# EAGLE design BrainControlBoard (EAGLE 8.4.3)
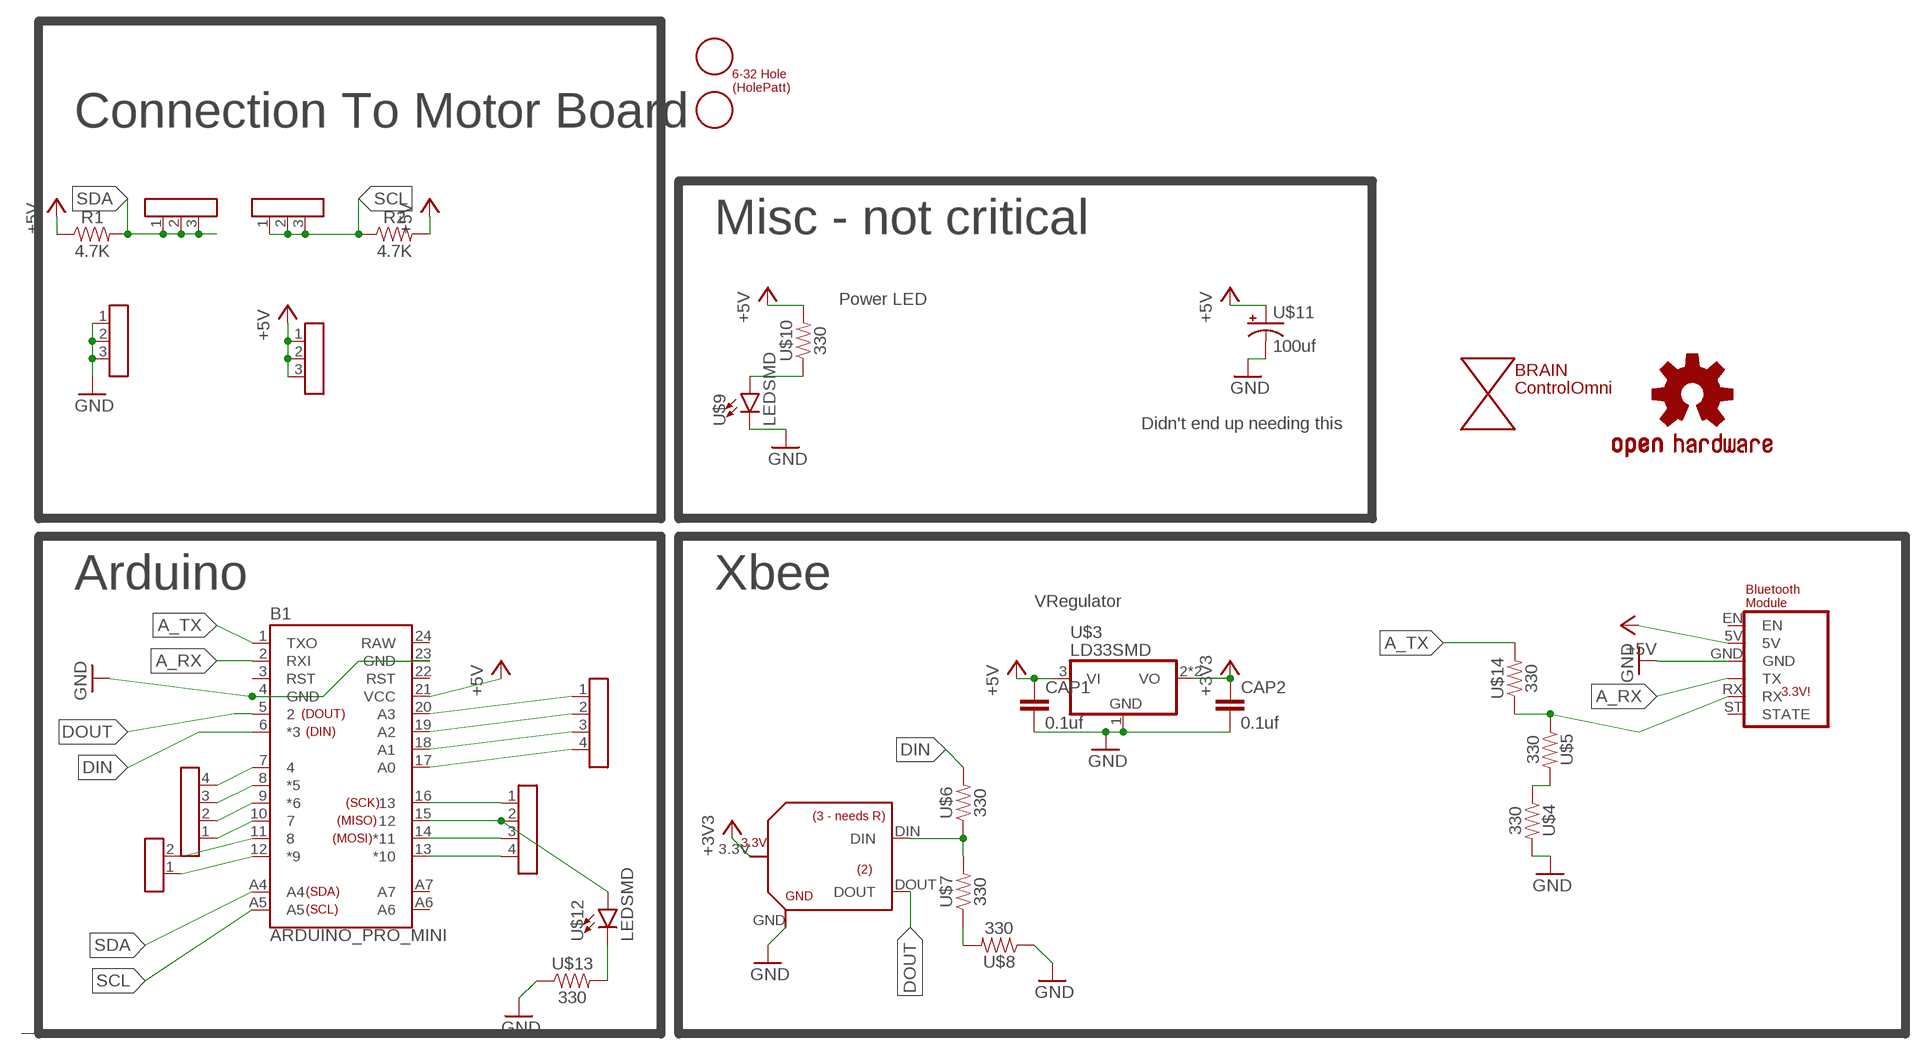
[diagram p0: schematic, sheet 1]

## Parts
B1  ARDUINO_PRO_MINI  [ARDUINO_PRO_MINI]
BRAIN  ControlOmni  ANNOTATION  [ANNOTATION]
CAP1  0.1uf  CAP_SMCAP  [C1206]
CAP2  0.1uf  CAP_SMCAP  [C1206]
LOGO1  OSHW-LOGOM  [OSHW-LOGO-M]
R1  4.7K  RESISTORSMD  [R1206]
R2  4.7K  RESISTORSMD  [R1206]
U$1  BLUETOOTH  [BLUETOOTH]
U$2  XBEE_BOUT  [XBEE_BOUT]
U$3  LD33SMD  [SOT223]
U$4  330  RESISTORSMD  [R1206]
U$5  330  RESISTORSMD  [R1206]
U$6  330  RESISTORSMD  [R1206]
U$7  330  RESISTORSMD  [R1206]
U$8  330  RESISTORSMD  [R1206]
U$9  LEDSMD  [LED_SMD]
U$10  330  RESISTORSMD  [R1206]
U$11  100uf  CAP_EMED  [CAP_E]
U$12  LEDSMD  [LED_SMD]
U$13  330  RESISTORSMD  [R1206]
U$14  330  RESISTORSMD  [R1206]
U$15  3XHEADER  [3XHEADER]
U$16  3XHEADER  [3XHEADER]
U$17  3XHEADER  [3XHEADER]
U$18  3XHEADER  [3XHEADER]
U$19  4XHEADER  [4XHEADER]
U$20  4XHEADER  [4XHEADER]
U$21  2XHEADER  [2XHEADER]
U$22  4XHEADER  [4XHEADER]
U$23  632X2  [632X2]

## Nets
+3V3 [pow]: CAP2.1 U$2.3.3V U$3.2(VO) U$3.4(VO)
+5V [pow]: B1.21(VCC) CAP1.1 R1.1 R2.2 U$1.5V U$3.3(VI) U$10.2 U$11.+ U$16.1 U$16.2 U$16.3
A0: B1.17(A0) U$19.4
A1: B1.18(A1) U$19.3
A2: B1.19(A2) U$19.2
A3: B1.20(A3) U$19.1
A_RX: B1.2(RXI) U$1.TX
A_TX: B1.1(TXO) U$14.2
DIN: B1.6(*3) U$6.2
DOUT: B1.5 U$2.DOUT
GND [pow]: B1.4(GND) B1.23(GND) CAP1.2 CAP2.2 U$1.GND U$2.GND U$3.1(GND) U$4.2 U$8.1 U$9.C U$11.- U$13.1 U$15.1 U$15.2 U$15.3
N$1: U$9.A U$10.1
N$3: U$7.1 U$8.2
N$4: U$2.DIN U$6.1 U$7.2
N$5: U$12.C U$13.2
N$6: U$4.1 U$5.2
N$7: U$1.RX U$5.1 U$14.1
P4: B1.7 U$20.4
P5: B1.8(*5) U$20.3
P6: B1.9(*6) U$20.2
P7: B1.10 U$20.1
P8: B1.11 U$21.2
P9: B1.12(*9) U$21.1
P10: B1.13(*10) U$22.4
P11: B1.14(*11) U$22.3
P12: B1.15 U$12.A U$22.2
P13: B1.16 U$22.1
SCL: B1.A5 R2.1 U$18.1 U$18.2 U$18.3
SDA: B1.A4 R1.2 U$17.1 U$17.2 U$17.3
Unconnected: B1.3(RST) B1.22(RST) B1.A6 B1.A7 U$1.EN U$1.ST(STATE)

## Notes on the sheet
- Connection To Motor Board
- Misc - not critical
- Power LED
- Didn't end up needing this
- Arduino | Xbee
- VRegulator

## Power pins joined to a net without a drawn wire
RAW: B1.24(RAW)

## Library data of the parts
B1 = Richard_Micros:ARDUINO_PRO_MINI: SparkFun Pro Mini Pro Mini compatible footprint. Dimensions: 0.7 x 1.3" PCB Thickness: 0.8mm SparkFun Products: 3.3V/8MHz <https://www.sparkfun.com/products/11114> 5V/16MHz <https://www.sparkfun.com/products/11113>
BRAIN = Richard_Symbols:ANNOTATION
CAP1 CAP2 = Richard_Components:CAP_SM
LOGO1 = Richard_Symbols:OSHW-LOGO: Open-Source Hardware (OSHW) Logo This logo indicates the piece of hardware it is found on incorporates a OSHW license and/or adheres to the definition of open source hardware found here: http://freedomdefined.org/OSHW
R1 R2 U$4-U$8 U$10 U$13 U$14 = Richard_Components:RESISTOR
U$1 = Richard_Boards:BLUETOOTH
U$2 = Richard_Boards:XBEE_BOUT
U$3 = Richard_Components:LD33
U$9 U$12 = Richard_Components:LED
U$11 = Richard_Components:CAP_E
U$15-U$18 = Richard_Headers:3XHEADER
U$19 U$20 U$22 = Richard_Headers:4XHEADER
U$21 = Richard_Headers:2XHEADER
U$23 = Richard_Holes:632X2

## Net classes
0 default: width 0.254 mm
1 pow: width 0.508 mm

## Board
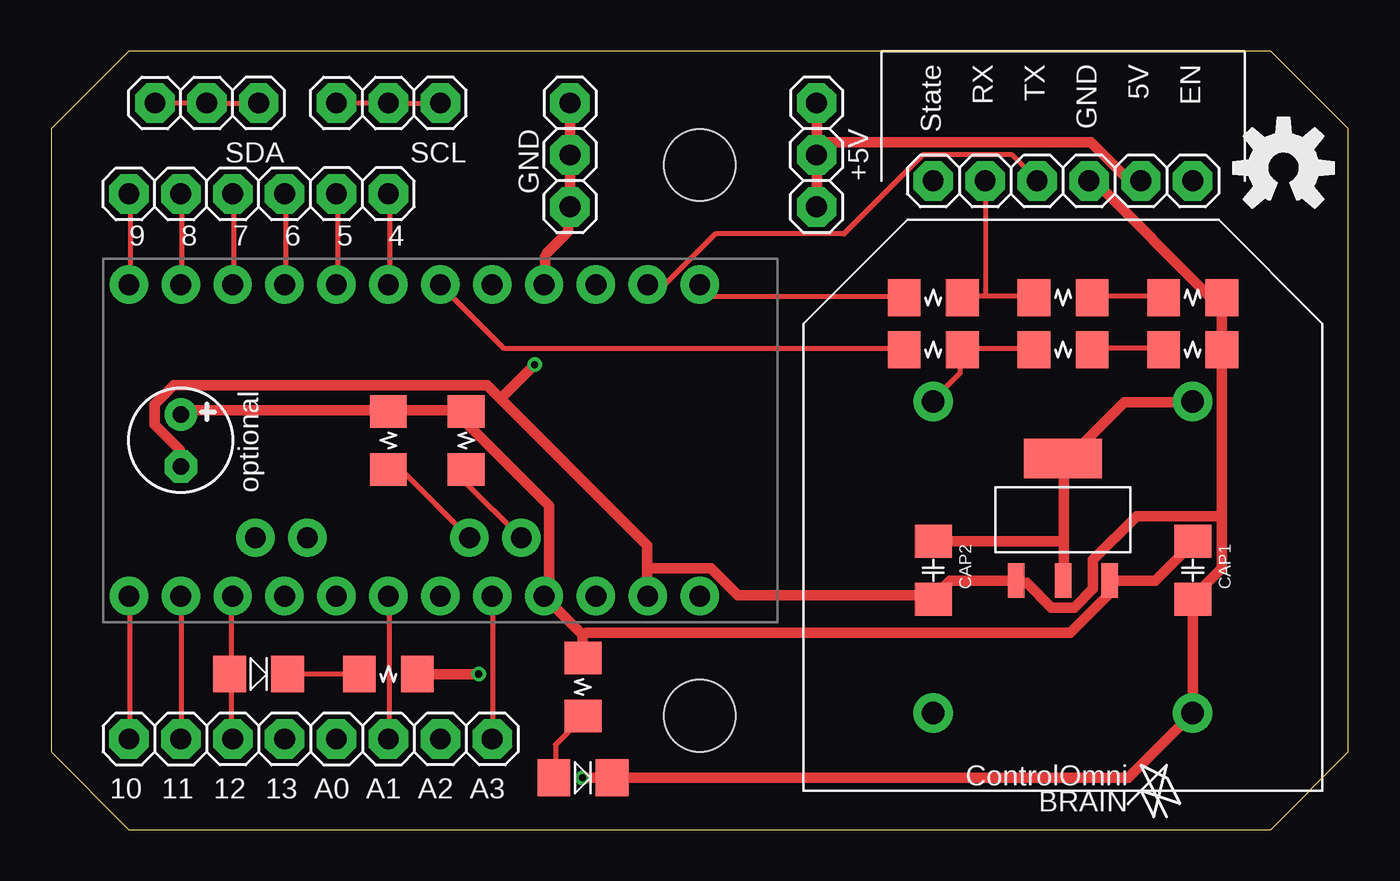
[diagram p1: board, top side]
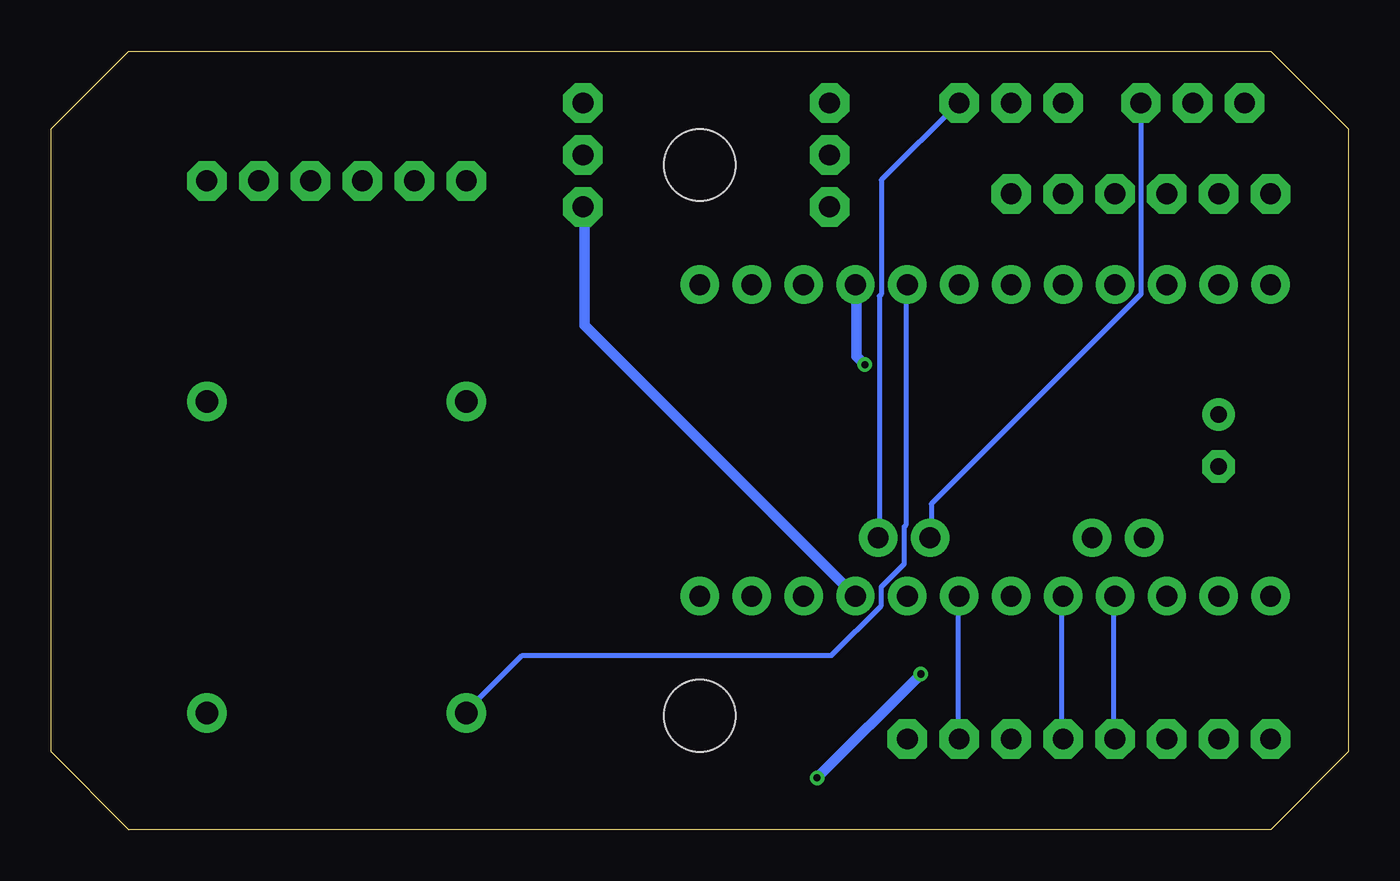
[diagram p2: board, bottom side, seen from below]

Size 63.5 x 38.1 mm. Coordinates in mm from the lower left corner, seen from the top.
Outline: 3.81,0 59.69,0 63.5,3.81 63.5,34.29 59.69,38.1 3.81,38.1 0,34.29 0,3.81 3.81,0
Copper layers (1*16): Top 0.0356mm / dielectric 1.5011mm / Bottom 0.0356mm
Design rules "LaenPCBOrder": minimum track width 6mil, minimum drill 13mil, track to track 6mil, track to pad 6mil, pad to pad 6mil, via to via 6mil, smd to smd 6mil, copper to edge 15mil, drill to drill 6mil, minimum pad ring 7mil, minimum via ring 7mil, stop-mask expansion 3mil, vias tented up to drill 0mil, thermal gap 10mil

### Footprints (pad centres in the part's own frame; a part is rotated, then mirrored left to right if it is on the bottom)
ARDUINO_PRO_MINI = drill 1.016 pad 1.88: 1 -7.62,12.7; 2 -7.62,10.16; 3 -7.62,7.62; 4 -7.62,5.08; 5 -7.62,2.54; 6 -7.62,0; 7 -7.62,-2.54; 8 -7.62,-5.08; 9 -7.62,-7.62; 10 -7.62,-10.16; 11 -7.62,-12.7; 12 -7.62,-15.24; 13 7.62,-15.24; 14 7.62,-12.7; 15 7.62,-10.16; 16 7.62,-7.62; 17 7.62,-5.08; 18 7.62,-2.54; 19 7.62,0; 20 7.62,2.54; 21 7.62,5.08; 22 7.62,7.62; 23 7.62,10.16; 24 7.62,12.7; A4 4.763,1.429; A5 4.763,3.969; A6 4.763,-9.049; A7 4.763,-6.509
C1206 = smd 1.6 x 1.803: 1 -1.422,0; 2 1.422,0
R1206 = smd 1.6 x 1.803: 1 -1.422,0; 2 1.422,0
BLUETOOTH = drill 1.016 pad 1.93 octagon: 5V 0,3.81; EN 0,6.35; GND 0,1.27; RX 0,-3.81; ST 0,-6.35; TX 0,-1.27
XBEE_BOUT = drill 1.1 pad 1.93: 3.3V -7.62,6.35; DIN -7.62,-6.35; DOUT 7.62,-6.35; GND 7.62,6.35
SOT223 = smd 0.813 x 1.676: 1 -2.286,-3.048; 2 0,-3.048; 3 2.286,-3.048 | smd 3.81 x 1.93: 4 0,2.921
LED_SMD = smd 1.6 x 1.803: A -1.422,0; C 1.422,0
CAP_E = drill 0.813 pad 1.6: + -1.27,0 | drill 0.813 pad 1.6 octagon: - 1.27,0
3XHEADER = drill 1.016 pad 1.93 octagon: 1 0,2.54; 2 0,0; 3 0,-2.54
4XHEADER = drill 1.016 pad 1.93 octagon: 1 0,3.81; 2 0,1.27; 3 0,-1.27; 4 0,-3.81
2XHEADER = drill 1.016 pad 1.93 octagon: 1 0,1.27; 2 0,-1.27
632X2 = hole 3.5: 0,-13.47; 0,13.47

### Placement (x,y rotation side)
B1  19.05,19.05 270 top
BRAIN  53.98,1.91 180 top
CAP1  55.88,12.7 270 top
CAP2  43.18,12.7 270 top
LOGO1  60.33,32.38 0 top
R1  16.51,19.05 270 top
R2  20.32,19.05 90 top
U$1  49.53,31.75 270 top
U$2  49.53,13.34 270 top
U$3  49.53,15.24 0 top
U$4  55.88,26.04 0 top
U$5  49.53,26.04 0 top
U$6  43.18,23.5 180 top
U$7  49.53,23.5 180 top
U$8  55.88,23.5 180 top
U$9  26.04,2.54 0 top
U$10  26.04,6.99 90 top
U$11  6.35,19.05 270 top
U$12  10.16,7.62 0 top
U$13  16.51,7.62 180 top
U$14  43.18,26.04 180 top
U$15  25.4,33.02 180 top
U$16  37.47,33.02 180 top
U$17  7.62,35.56 90 top
U$18  16.51,35.56 90 top
U$19  17.78,4.45 270 top
U$20  12.7,31.11 90 top
U$21  5.08,31.11 90 top
U$22  7.62,4.45 270 top
U$23  31.75,19.05 180 top

### Tracks (layer width: path | path; a pad name or v marks a point on that pad's centre or on a via)
+3V3
  Top 0.508: 49.58,14.12 49.58,18.09 U$3.4 49.78,18.19 52.53,20.93 55.88,20.93 U$2.3.3V | 49.58,14.12 49.58,12.19 U$3.2 | 49.58,14.12 CAP2.1 | CAP2.1
+5V
  Top 0.508: U$11.+ 6.4,20.32 6.6,20.52 16.26,20.52 R1.1 16.56,20.52 20.32,20.52 R2.2 20.42,20.22 20.42,19.81 24.38,15.85 24.38,11.48 B1.21 26.01,9.55 | CAP1.1 55.88,14.02 54.05,12.19 U$3.3 51.71,11.99 51.71,11.48 49.89,9.65 26.21,9.65 26.01,9.55 | 26.01,9.55 26.01,8.43 U$10.2 | U$16.1 37.49,30.48 37.49,33.02 U$16.2 | U$16.3 37.49,35.56 37.49,33.22 U$16.2 | U$1.5V 53.34,31.8 52.73,31.8 50.9,33.63 37.69,33.63 U$16.2
  Bottom 0.508: B1.21 37.39,24.69 37.39,30.48 U$16.1
A0
  Bottom 0.254: B1.17 14.02,11.38 14.02,4.47 U$19.4
A1
  Top 0.254: B1.18 16.56,11.38 16.56,4.47 U$19.3
A2
  Bottom 0.254: B1.19 19.1,11.38 19.1,4.47 U$19.2
A3
  Top 0.254: B1.20 21.64,11.38 21.64,4.47 U$19.1
A_RX
  Top 0.254: B1.2 29.26,26.72 30.07,26.72 32.51,29.16 38.81,29.16 42.67,33.02 47.04,33.02 48.26,31.8 U$1.TX
A_TX
  Top 0.254: B1.1 32.31,26.11 41.76,26.11 U$14.2
DIN
  Top 0.254: B1.6 22.15,23.57 41.76,23.57 U$6.2
DOUT
  Bottom 0.254: B1.5 21.64,26.62 21.64,14.94 21.74,14.83 21.74,13.01 22.86,11.89 22.86,10.97 25.3,8.53 40.44,8.53 43.18,5.79 U$2.DOUT
GND  (via drill 0.35)
  Top 0.508: B1.4 24.18,26.72 24.18,28.04 24.28,28.25 25.3,29.26 25.3,30.28 U$15.1 U$15.2 U$15.3 | 22,21.08 29.16,13.92 29.16,12.8 | 22,21.08 21.34,21.74 5.99,21.74 5.08,20.83 5.08,19.81 6.3,18.59 6.3,17.78 U$11.- | 29.16,12.8 29.16,11.48 B1.23 | 29.16,12.8 32.31,12.8 33.63,11.48 42.98,11.48 CAP2.2 43.18,11.38 43.99,12.19 U$3.1 47.45,12.09 47.75,12.09 48.97,10.87 50.09,10.87 51,11.79 51,13.21 53.14,15.34 57.3,15.34 | 22,21.08 v23.67,22.76 | U$1.GND 50.8,31.7 51.1,31.7 56.69,26.11 57.1,26.11 U$4.2 57.3,26.01 57.3,23.57 U$8.1 57.3,23.27 57.3,15.34 | v20.93,7.62 U$13.1 | v26.01,2.54 U$9.C 52.73,2.54 55.88,5.69 U$2.GND CAP1.2 55.98,11.48 57.3,12.8 57.3,15.34
  Bottom 0.508: v23.67,22.76 24.08,23.16 24.08,26.62 B1.4 | v26.01,2.54 v20.93,7.62
N$1
  Top 0.254: U$9.A 24.69,2.54 24.69,4.17 26.01,5.49 U$10.1
N$3
  Top 0.254: U$7.1 51,23.57 54.46,23.57 U$8.2
N$4
  Top 0.254: U$2.DIN 43.18,21.03 44.5,22.35 44.5,23.47 U$6.1 44.7,23.57 48.06,23.57 U$7.2
N$5
  Top 0.254: U$13.2 U$12.C
N$6
  Top 0.254: U$5.2 51,26.11 54.46,26.11 U$4.1
N$7
  Top 0.254: 45.72,26.11 48.06,26.11 U$5.1 | 45.72,26.11 44.6,26.11 U$14.1 | U$1.RX 45.72,26.11
P4
  Top 0.254: B1.7 16.56,26.72 16.56,31.09 U$20.4
P5
  Top 0.254: B1.8 14.02,26.72 14.02,31.09 U$20.3
P6
  Top 0.254: B1.9 11.48,26.72 11.48,31.09 U$20.2
P7
  Top 0.254: B1.10 8.94,26.72 8.94,31.09 U$20.1
P8
  Top 0.254: B1.11 6.4,26.72 6.4,31.09 U$21.2
P9
  Top 0.254: B1.12 3.86,26.72 3.86,31.09 U$21.1
P10
  Top 0.254: B1.13 3.86,11.38 3.86,4.47 U$22.4
P11
  Top 0.254: B1.14 6.4,11.38 6.4,4.47 U$22.3
P12
  Top 0.254: U$22.2 8.84,4.47 8.84,7.62 U$12.A 8.84,7.72 8.84,11.38 B1.15
P13
  Bottom 0.254: B1.16 11.48,11.38 11.48,4.47 U$22.1
SCL
  Top 0.254: R2.1 20.32,16.97 22.96,14.33 B1.A5 | U$18.1 U$18.2 U$18.3
  Bottom 0.254: B1.A5 22.96,14.33 22.96,26.11 22.86,26.21 22.86,31.8 19.1,35.56 U$18.3
SDA
  Top 0.254: R1.2 16.56,17.58 17.17,17.58 20.42,14.33 B1.A4 | U$17.1 U$17.2 U$17.3
  Bottom 0.254: U$17.3 10.16,26.21 20.42,15.95 20.42,14.33 B1.A4

### Text on the board
tPlace: SDA | SCL | GND | +5V | 9 | 8 | 7 | 6 | 5 | 4 | optional | 10 | 11 | 12 | 13 | A0 | A1 | A2 | A3